# Altium schematic sheet 1_P1.schdoc
size 309 x 223 mm; Symbol: Sheet-Symbol_A4; Device: Sheet-Symbol_A4; @Page Name: P1; @Create Date: 2023-06-22; @Page Count: 1; @Page No: 1; @Project Name: LED点阵最终版; @Schematic Name: Schematic1; @Update Date: 2023-06-23; Company: 嘉立创EDA; Page Size: A4; Version: V1.0
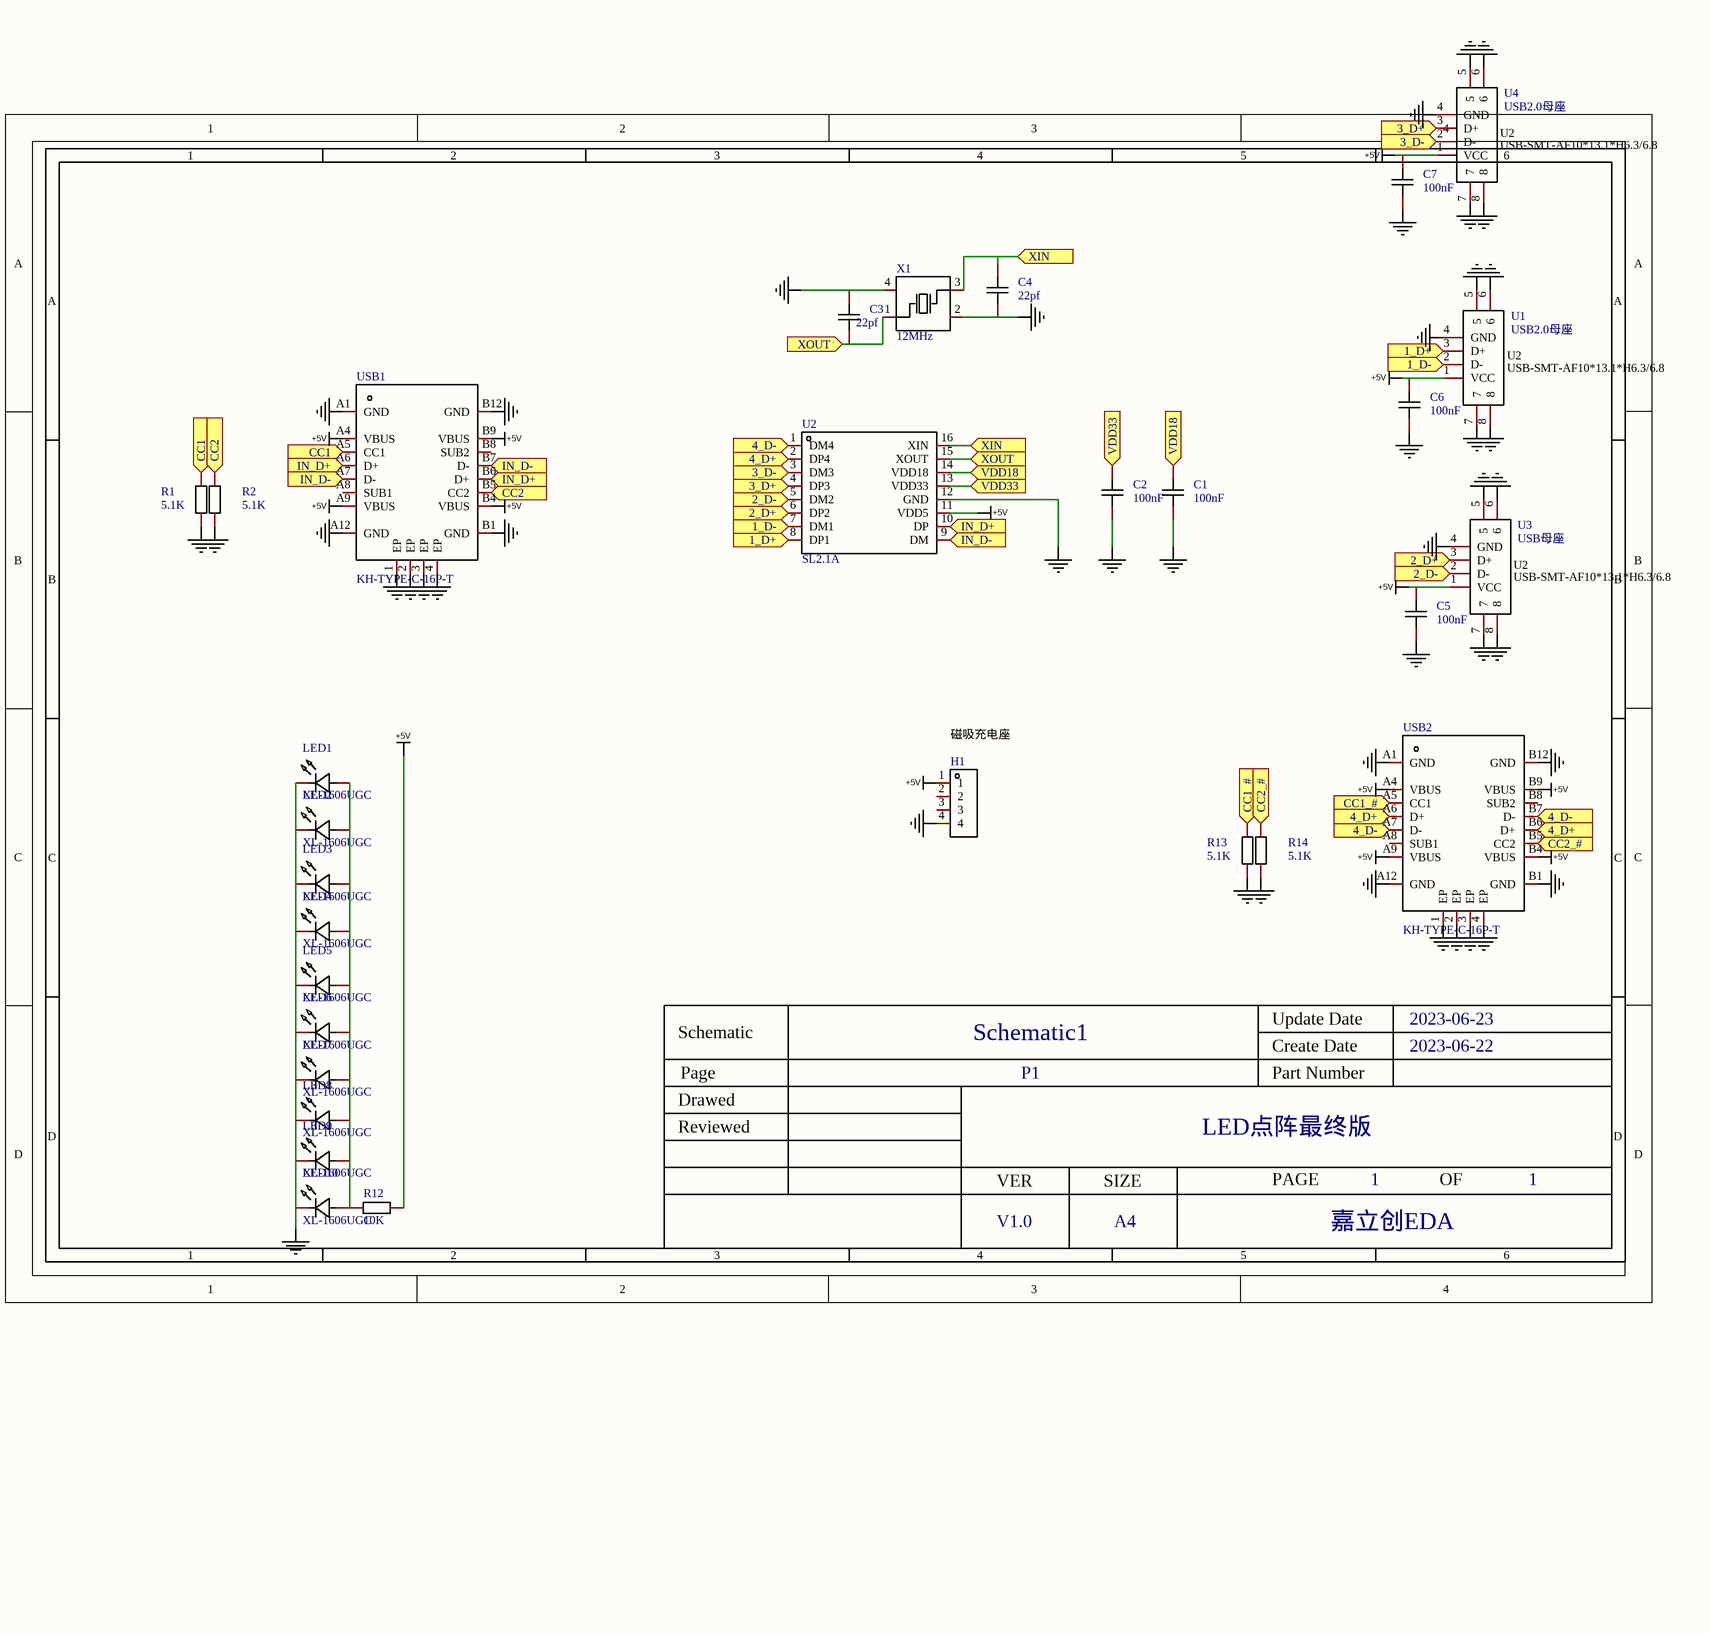
[diagram p0: 1_P1.schdoc]

## Parts
C1  100nF  [C0603]
C2  100nF  [C0603]
C3  22pf  [C0603]
C4  22pf  [C0603]
C5  100nF  [C0603]
C6  100nF  [C0603]
C7  100nF  [C0603]
H1  HDR-M_2.54_1x4P  [HDR-TH_4P-P2.54-V-M]  (value not drawn)
LED1  XL-1606UGC  [LED-SMD_L1.7-W1.1-R-RD_GREEN]
LED2  XL-1606UGC  [LED-SMD_L1.7-W1.1-R-RD_GREEN]
LED3  XL-1606UGC  [LED-SMD_L1.7-W1.1-R-RD_GREEN]
LED4  XL-1606UGC  [LED-SMD_L1.7-W1.1-R-RD_GREEN]
LED5  XL-1606UGC  [LED-SMD_L1.7-W1.1-R-RD_GREEN]
LED6  XL-1606UGC  [LED-SMD_L1.7-W1.1-R-RD_GREEN]
LED7  XL-1606UGC  [LED-SMD_L1.7-W1.1-R-RD_GREEN]
LED8  XL-1606UGC  [LED-SMD_L1.7-W1.1-R-RD_GREEN]
LED9  XL-1606UGC  [LED-SMD_L1.7-W1.1-R-RD_GREEN]
LED10  XL-1606UGC  [LED-SMD_L1.7-W1.1-R-RD_GREEN]
R1  5.1K  [R0603]
R2  5.1K  [R0603]
R12  10K  [R0603]
R13  5.1K  [R0603]
R14  5.1K  [R0603]
U1  Name: USB2.0母座  [USB-SMT-AF10.0-13.1*6.8/6.3]  (hidden comment: USB-SMT-AF10.0-13.1*6.8/6.3)
U2  SL2.1A  [SOP-16_L10.0-W3.9-P1.27-LS6.0-BL]
U3  USB母座  [USB-SMT-AF10.0-13.1*6.8/6.3]
U4  Name: USB2.0母座  [USB-SMT-AF10.0-13.1*6.8/6.3]  (hidden comment: USB-SMT-AF10.0-13.1*6.8/6.3)
USB1  KH-TYPE-C-16P-T  [USB-C-SMD_KH-TYPE-C-16P]
USB2  KH-TYPE-C-16P-T  [USB-C-SMD_KH-TYPE-C-16P]
X1  12MHz  [OSC-SMD_4P-L3.2-W2.5-BL]

## Ports
1_D+ (in), 1_D- (in), 2_D+ (in), 2_D- (in), 3_D+ (in), 3_D- (in), 4_D+ (in), 4_D- (in), CC1 (in), CC1_# (in), CC2 (in), CC2_# (in), IN_D+ (in), IN_D- (in), VDD18 (in), VDD33 (in), XIN (in), XOUT (in)

## Nets
+5V: C5.2 C6.2 C7.2 H1.1 R12.2 U1.1(VCC) U2.11(VDD5) U3.1(VCC) U4.1(VCC) USB1.A4(VBUS) USB1.A9(VBUS) USB1.B4(VBUS) USB1.B9(VBUS) USB2.A4(VBUS) USB2.A9(VBUS) USB2.B4(VBUS) USB2.B9(VBUS)
NetC1_2: C1.2 C2.2 C3.2 C4.1 C5.1 C6.1 C7.1 H1.4 LED1.2(K) LED2.2(K) LED3.2(K) LED4.2(K) LED5.2(K) LED6.2(K) LED7.2(K) LED8.2(K) LED9.2(K) LED10.2(K) R1.1 R2.1 R13.1 R14.1 U1.4(GND) U1.5 U1.6 U1.7 U1.8 U2.12(GND) U3.4(GND) U3.5 U3.6 U3.7 U3.8 U4.4(GND) U4.5 U4.6 U4.7 U4.8 USB1.1(EP) USB1.2(EP) USB1.3(EP) USB1.4(EP) USB1.A1(GND) USB1.A12(GND) USB1.B1(GND) USB1.B12(GND) USB2.1(EP) USB2.2(EP) USB2.3(EP) USB2.4(EP) USB2.A1(GND) USB2.A12(GND) USB2.B1(GND) USB2.B12(GND) X1.2(GND) X1.4(GND)
1_D+: U1.3(D+) U2.8(DP1) ; port 1_D+
1_D-: U1.2(D-) U2.7(DM1) ; port 1_D-
2_D+: U2.6(DP2) U3.3(D+) ; port 2_D+
2_D-: U2.5(DM2) U3.2(D-) ; port 2_D-
3_D+: U2.4(DP3) U4.3(D+) ; port 3_D+
3_D-: U2.3(DM3) U4.2(D-) ; port 3_D-
4_D+: U2.2(DP4) USB2.A6(D+) USB2.B6(D+) ; port 4_D+
4_D-: U2.1(DM4) USB2.A7(D-) USB2.B7(D-) ; port 4_D-
CC1: R1.2 USB1.A5(CC1) ; port CC1
CC1_#: R13.2 USB2.A5(CC1) ; port CC1_#
CC2: R2.2 USB1.B5(CC2) ; port CC2
CC2_#: R14.2 USB2.B5(CC2) ; port CC2_#
IN_D+: U2.10(DP) USB1.A6(D+) USB1.B6(D+) ; port IN_D+
IN_D-: U2.9(DM) USB1.A7(D-) USB1.B7(D-) ; port IN_D-
VDD18: C1.1 U2.14(VDD18) ; port VDD18
VDD33: C2.1 U2.13(VDD33) ; port VDD33
XIN: C4.2 U2.16(XIN) X1.3(OSC2) ; port XIN
XOUT: C3.1 U2.15(XOUT) X1.1(OSC1) ; port XOUT
NetLED1_1: LED1.1(A) LED2.1(A) LED3.1(A) LED4.1(A) LED5.1(A) LED6.1(A) LED7.1(A) LED8.1(A) LED9.1(A) LED10.1(A) R12.1

Not connected (* = marked no-connect by the designer): H1 2 3; USB1 A8(SUB1) B8(SUB2); USB2 A8(SUB1) B8(SUB2)

## Notes on the sheet
- (near H1) 磁吸充电座
- 1
- 2
- 3
- 4
- 5
- 6
- A
- B
- C
- Schematic
- Schematic1
- Create Date
- Update Date
- 2023-06-22
- 2023-06-23
- Reviewed
- Drawed
- Page
- P1
- Part Number
- LED点阵最终版
- D
- VER
- SIZE
- PAGE
- OF
- V1.0
- A4
- 嘉立创EDA
- (in symbol USB-SMT-AF10.0-13.1*6.8/6.3) U2; USB-SMT-AF10*13.1*H6.3/6.8

## Library data of the parts
C1-C7 = CAP_0603: Symbol: CapAcitance; Convert to PCB: yes; Device: CAP_0603; Add into BOM: yes; Supplier Footprint: 0603
  C1 C2 C5-C7: Name: 100nF; Value: 100nF
  C3 C4: Name: 22pf; Value: 22pf
H1 = HDR-M_2.54_1x4P: Symbol: PZ254V-11-04P; Convert to PCB: yes; Device: HDR-M_2.54_1x4P; Add into BOM: yes; Supplier Part: C492403; Supplier Footprint: 插件; NO_CONNECT: yes
LED1-LED10 = XL-1606UGC: 发光颜色:翠绿;主波长:520nm~530nm;色温:-;功率:80mW;安装方式:侧贴;; Manufacturer: XINGLIGHT(成兴光); Add into BOM: yes; Emitted Color: 翠绿; Lens Color: 无色透明; Peak Wavelength: 535nm; Forward Current: 25mA; Power Dissipation: 80mW; Viewing Angle: 120°; Mounting Sytle: 侧贴; Name: XL-1606UGC; Symbol: XL-1606UGC; Device: XL-1606UGC; LCSC Part Name: 翠绿 侧贴; Supplier Part: C965863; Manufacturer Part: XL-1606UGC; Supplier Footprint: SMD,1.1x1.7mm; JLCPCB Part Class: 扩展库; Datasheet: https://atta.szlcsc.com/upload/public/pdf/source/20221102/94FA3AB05D9E652787BBD0AFAAE97065.pdf; Supplier: LCSC; Convert to PCB: yes; Dominant Wavelength: 520nm~530nm; Color Temperature: -; Operating Temperature: -30℃~+85℃
R1 R2 R12-R14 = Res_0603: Symbol: 电阻; Convert to PCB: yes; Device: Res_0603; Add into BOM: yes; Supplier Footprint: 0603
  R1 R2 R13 R14: Name: 5.1K; Value: 5.1K
  R12: Name: 10K; Value: 10K
U1 U3 U4 = USB-SMT-AF10.0-13.1*6.8/6.3: Add into BOM: yes; Symbol: USB-SMT-AF10.0-13.1*6.8/6.3; Device: USB-SMT-AF10.0-13.1*6.8/6.3; Convert to PCB: yes
  U3: Name: USB母座
U2 = SL2.1A: 应用功能:集线器;接口协议:-;; Manufacturer: CoreChips(和芯润德); Add into BOM: yes; Applications Function: 集线器; Name: SL2.1A; Symbol: SL2.1A; Device: SL2.1A; LCSC Part Name: SL2.1A USB2.0 HUB 控制器集成电路; Supplier Part: C192893; Manufacturer Part: SL2.1A; Supplier Footprint: SOP-16; JLCPCB Part Class: 扩展库; Datasheet: https://atta.szlcsc.com/upload/public/pdf/source/20180522/C192893_624110D24898D57AAC785E3DF98EA862.pdf; Supplier: LCSC; Convert to PCB: yes; Protocol: -
USB1 USB2 = KH-TYPE-C-16P-T: 连接器类型:Type-C;标准:-;公母:母座;触点数量:16;端口数量:1;安装方式:卧贴;额定电流 - 电源:500mA;工作温度范围:-30℃~+80℃;; Manufacturer: kinghelm(金航标); Add into BOM: yes; Connector Type: Type-C; Gender: 母座; Number of Contacts: 16; Number of Ports: 1; Current Rating - Power (Max): 500mA; Name: KH-TYPE-C-16P-T; Symbol: KH-TYPE-C-16P-T; Device: KH-TYPE-C-16P-T; LCSC Part Name: Type-C 母座 卧贴; Supplier Part: C709358; Manufacturer Part: KH-TYPE-C-16P-T; Supplier Footprint: SMD; JLCPCB Part Class: 扩展库; Datasheet: https://atta.szlcsc.com/upload/public/pdf/source/20200722/C709358_5A99A991362FD50EC94EB58A838F95BB.pdf; Supplier: LCSC; Convert to PCB: yes; Standard: -; Mounting Style: 卧贴; Operating Temperature Range: -30℃~+80℃; NO_CONNECT: yes
X1 = X322512MSB4SI: 频率:12MHz;频率公差:±10ppm;负载电容:20pF;; Manufacturer: YXC(扬兴晶振); Add into BOM: yes; Crystal Type: 贴片无源晶振; Frequency Tolerance: ±10ppm; Frequency Stability: ±30ppm; Load Capacitance: 20pF; Name: 12MHz; Symbol: X322512MSB4SI; Device: X322512MSB4SI; LCSC Part Name: 12MHz ±10ppm 20pF YSX321SL; Supplier Part: C9002; Manufacturer Part: X322512MSB4SI; Supplier Footprint: SMD3225-4P; JLCPCB Part Class: 基础库; Datasheet: https://atta.szlcsc.com/upload/public/pdf/source/20210329/C112971_1F611BDC486E193C1706F6D8EB5AA189.pdf; Supplier: LCSC; Convert to PCB: yes; Value: 12MHz; Operating Temperature: -40℃~+85℃